# Altium schematic sheet Capa.SchDoc
size A3; DocumentNumber: 1; SheetNumber: 1; SheetTotal: 15
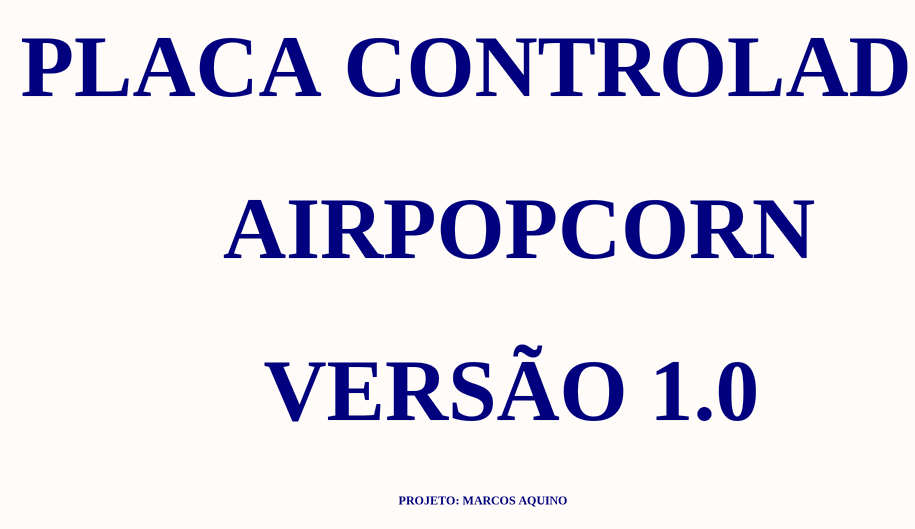
[diagram p0: Capa.SchDoc]

## Notes on the sheet
- PLACA CONTROLADORA
- AIRPOPCORN
- VERSÃO 1.0
- PROJETO: MARCOS AQUINO